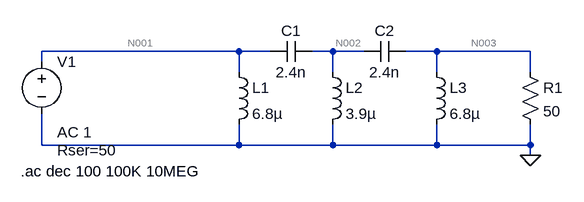
[diagram p0: schematic High_Pass_1MHz.asc]
High_Pass_1MHz.asc, the LTspice schematic file:
Version 4
SHEET 1 920 680
WIRE 416 96 112 96
WIRE 464 96 416 96
WIRE 560 96 528 96
WIRE 608 96 560 96
WIRE 720 96 672 96
WIRE 864 96 720 96
WIRE 112 112 112 96
WIRE 416 128 416 96
WIRE 560 128 560 96
WIRE 720 128 720 96
WIRE 864 128 864 96
WIRE 112 240 112 192
WIRE 416 240 416 208
WIRE 416 240 112 240
WIRE 560 240 560 208
WIRE 560 240 416 240
WIRE 720 240 720 208
WIRE 720 240 560 240
WIRE 864 240 864 208
WIRE 864 240 720 240
WIRE 864 256 864 240
FLAG 864 256 0
SYMBOL voltage 112 96 R0
WINDOW 123 24 124 Left 2
WINDOW 39 24 152 Left 2
SYMATTR Value2 AC 1
SYMATTR SpiceLine Rser=50
SYMATTR InstName V1
SYMATTR Value ""
SYMBOL ind 400 112 R0
SYMATTR InstName L1
SYMATTR Value 6.8µ
SYMBOL ind 544 112 R0
SYMATTR InstName L2
SYMATTR Value 3.9µ
SYMBOL ind 704 112 R0
SYMATTR InstName L3
SYMATTR Value 6.8µ
SYMBOL res 848 112 R0
SYMATTR InstName R1
SYMATTR Value 50
SYMBOL cap 528 80 R90
WINDOW 0 0 32 VBottom 2
WINDOW 3 32 32 VTop 2
SYMATTR InstName C1
SYMATTR Value 2.4n
SYMBOL cap 672 80 R90
WINDOW 0 0 32 VBottom 2
WINDOW 3 32 32 VTop 2
SYMATTR InstName C2
SYMATTR Value 2.4n
TEXT 80 280 Left 2 !.ac dec 100 100K 10MEG

The netlist it stands for:
* High_Pass_1MHz.asc
V1 N001 0 AC 1 Rser=50
L1 N001 0 6.8µ
L2 N002 0 3.9µ
L3 N003 0 6.8µ
R1 N003 0 50
C1 N002 N001 2.4n
C2 N003 N002 2.4n
.ac dec 100 100K 10MEG
.backanno
.end

* Results of the author's LTspice run, read from the files saved beside the schematic
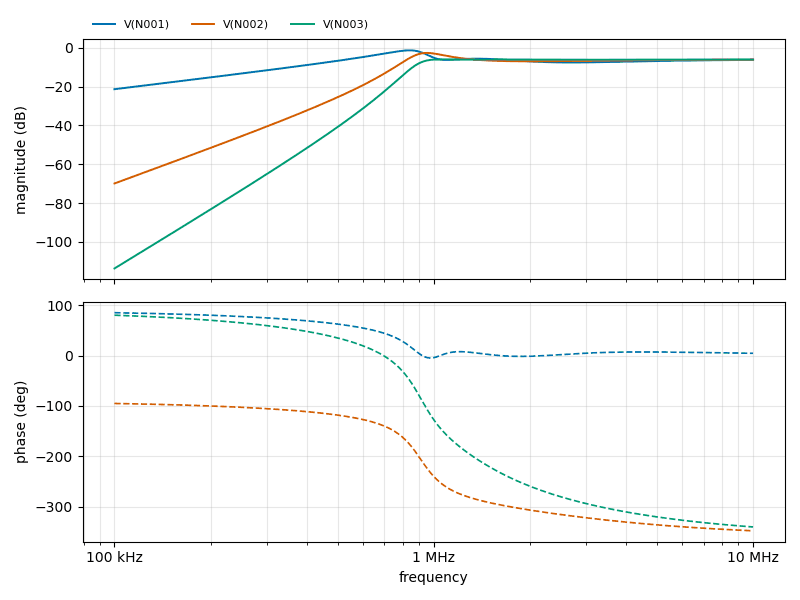
[diagram p1: AC Analysis of High_Pass_1MHz.asc, plotted from the saved traces]
* AC Analysis, 1 run:
*   V(N001): -21.34 dB at 100 kHz, -6.24 dB at 10 MHz, peak -1.32 dB at 831.8 kHz, 3 dB below the peak at 623.9 kHz and 973.9 kHz
*   V(N002): -69.92 dB at 100 kHz, -6.11 dB at 10 MHz, peak -2.65 dB at 955 kHz, 3 dB below the peak at 832.5 kHz and 1.262 MHz
*   V(N003): -113.72 dB at 100 kHz, -6.05 dB at 10 MHz, peak -6.02 dB at 1.622 MHz, 3 dB below the peak at 877 kHz